# Altium project UprightAccelerationController.PrjPCB
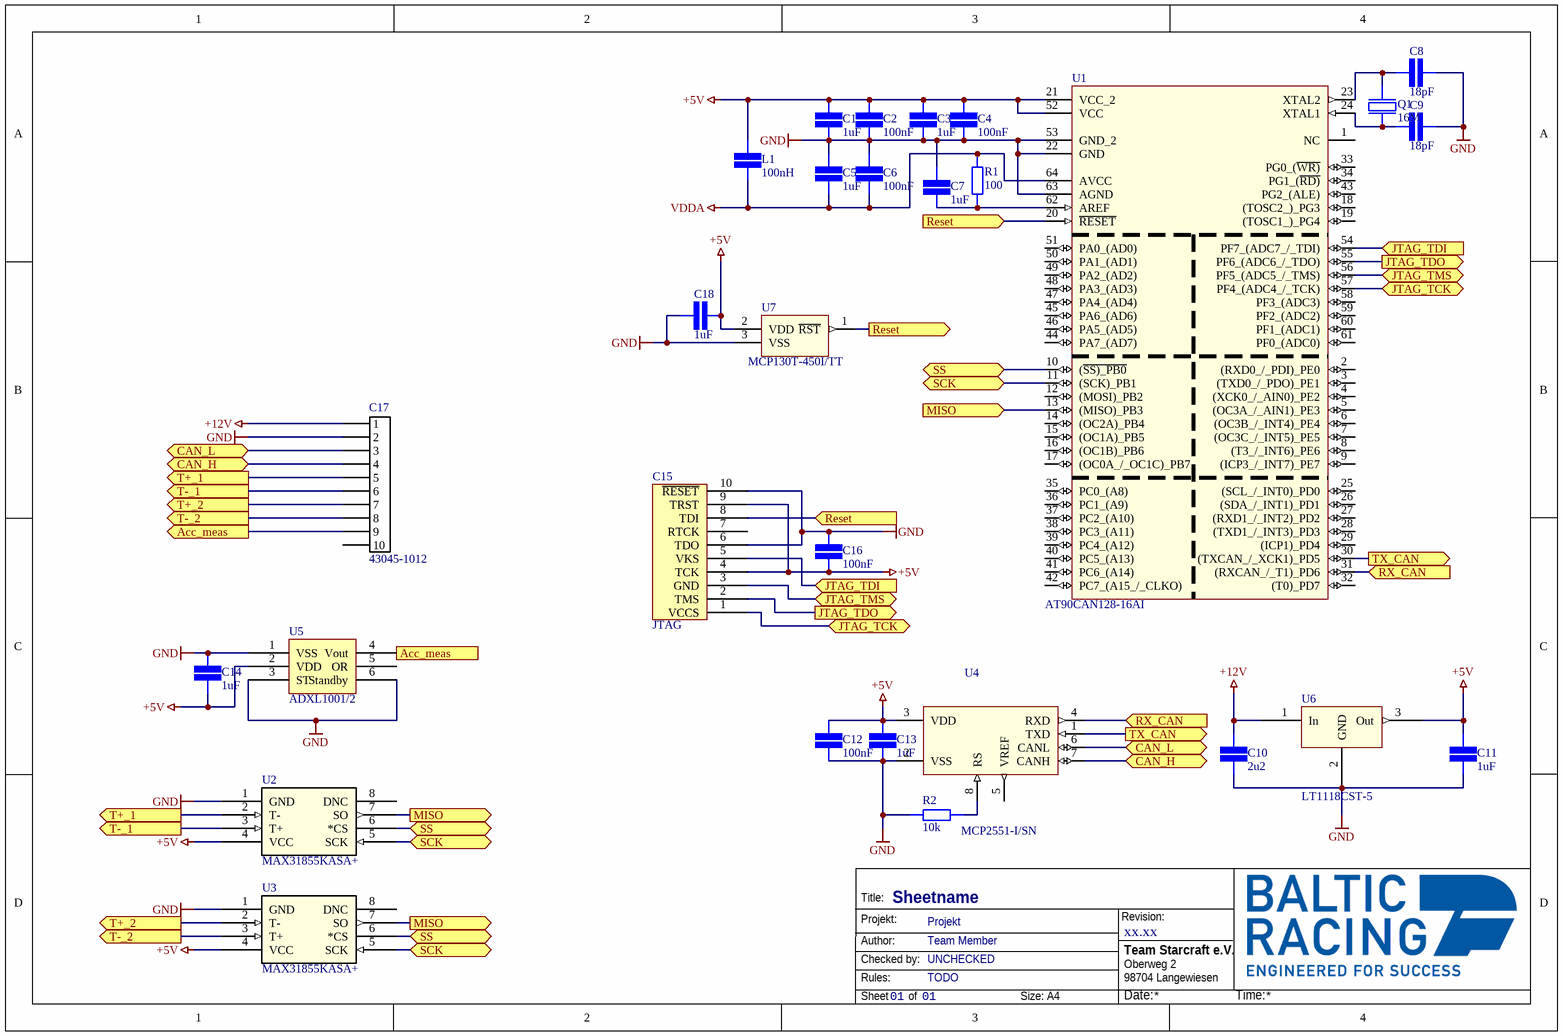
[diagram p0: main.SchDoc]
1 sheet, 29 parts. Net scope: flat (ports and power ports of the same name join across sheets).
Board file: UAC.PcbDoc

## Sheet main.SchDoc: Sheetname
size A4; Date: 05.10.2017; CheckedBy: UNCHECKED; Author: Team Member; Organization: Team Starcraft e.V.; Address1: Oberweg 2; Address2: 98704 Langewiesen; Revision: xx.xx; SheetNumber: 01; SheetTotal: 01; Rules: TODO; ProjectName: Projekt

### Parts
C1  value 1uF  [CAP 0603/1608]  (hidden comment: SMD Capacitor)
C2  value 100nF  [CAP 0603/1608]  (hidden comment: SMD Capacitor)
C3  value 1uF  [CAP 0603/1608]  (hidden comment: SMD Capacitor)
C4  value 100nF  [CAP 0603/1608]  (hidden comment: SMD Capacitor)
C5  value 1uF  [CAP 0603/1608]  (hidden comment: SMD Capacitor)
C6  value 100nF  [CAP 0603/1608]  (hidden comment: SMD Capacitor)
C7  value 1uF  [CAP 0603/1608]  (hidden comment: SMD Capacitor)
C8  value 18pF  [CAP 0603/1608]  (hidden comment: SMD Capacitor)
C9  value 18pF  [CAP 0603/1608]  (hidden comment: SMD Capacitor)
C10  value 2u2  [CAP 0603/1608]  (hidden comment: SMD Capacitor)
C11  value 1uF  [CAP 0603/1608]  (hidden comment: SMD Capacitor)
C12  value 100nF  [CAP 0603/1608]  (hidden comment: SMD Capacitor)
C13  value 1uF  [CAP 0603/1608]  (hidden comment: SMD Capacitor)
C14  value 1uF  [CAP 0603/1608]  (hidden comment: SMD Capacitor)
C15  JTAG  [SEGGER_10_PIN]  (no BOM)
C16  value 100nF  [CAP 0603/1608]  (hidden comment: SMD Capacitor)
C17  43045-1012  [43045-1012]
C18  value 1uF  [CAP 0603/1608]  (hidden comment: SMD Capacitor)
L1  value 100nH  [CAP 0603/1608]  (hidden comment: SMD Capacitor)
Q1  16M  [NDK NX5032GA]
R1  value 100  [STACKPOLE CSR0603]  (hidden comment: SMD Resistor)
R2  value 10k  [STACKPOLE CSR0603]  (hidden comment: SMD Resistor)
U1  AT90CAN128-16AI  [*QFP80P1600X1600X120-64N]
U2  MAX31855KASA+  [SOIC8]
U3  MAX31855KASA+  [SOIC8]
U4  MCP2551-I/SN  [*SOIC127P600X175-8N]
U5  ADXL1001/2  [PCBComponent_1]
U6  LT1118CST-5  [*SOT230P700X180-4N]
U7  MCP130T-450I/TT  [*SOT95P237X112-3N]

### Ports
Acc_meas (out), CAN_H (bidir), CAN_L (bidir), JTAG_TCK (bidir), JTAG_TDI (in), JTAG_TDO (out), JTAG_TMS (bidir), MISO (in), MISO (out), Reset (in), Reset (out), RX_CAN (in), SCK (bidir), SS (bidir), T+_1 (out), T+_2 (out), T-_1 (out), T-_2 (out), TX_CAN (out)

### Nets
+5V: C1.2 C2.2 C3.2 C4.2 C11.2 C12.2 C13.2 C14.1 C15.4(TCK) C15.9(TRST) C16.1 C18.1 L1.2 U1.21(VCC_2) U1.52(VCC) U2.4(VCC) U3.4(VCC) U4.3(VDD) U5.2(VDD) U6.3(Out) U7.2(VDD)
+12V: C10.2 C17.1 U6.1(In)
GND: C1.1 C2.1 C3.1 C4.1 C5.2 C6.2 C7.2 C8.1 C9.1 C10.1 C11.1 C12.1 C13.1 C14.2 C15.6(TDO) C15.10(~{RESET}) C16.2 C17.2 C18.2 R2.1 U1.22(GND) U1.53(GND_2) U1.63(AGND) U2.1(GND) U3.1(GND) U4.2(VSS) U5.1(VSS) U5.3(ST) U5.6(Standby) U6.2(GND) U7.3(VSS)
VDDA: C5.1 C6.1 L1.1 R1.2 U1.64(AVCC)
NetC7_1: C7.1 R1.1 U1.62(AREF)
NetC8_2: C8.2 Q1.2 U1.23(XTAL2)
NetC9_2: C9.2 Q1.1 U1.24(XTAL1)
NetC15_1: C15.1(VCCS) U1.57(PF4_(ADC4_/_TCK)) ; port JTAG_TCK
NetC15_2: C15.2(TMS) U1.55(PF6_(ADC6_/_TDO)) ; port JTAG_TDO
NetC15_3: C15.3(GND) U1.56(PF5_(ADC5_/_TMS)) ; port JTAG_TMS
NetC15_5: C15.5(VKS) U1.54(PF7_(ADC7_/_TDI)) ; port JTAG_TDI
NetC15_8: C15.8(TDI) U1.20(~{RESET}) U7.1(~{RST}) ; port Reset
NetC17_3: C17.3 U4.6(CANL) ; port CAN_L
NetC17_4: C17.4 U4.7(CANH) ; port CAN_H
NetC17_5: C17.5 U2.2(T-) ; port T+_1
NetC17_6: C17.6 U2.3(T+) ; port T-_1
NetC17_7: C17.7 U3.2(T-) ; port T+_2
NetC17_8: C17.8 U3.3(T+) ; port T-_2
NetC17_9: C17.9 U5.4(Vout) ; port Acc_meas
NetR2_2: R2.2 U4.8(RS)
NetU1_10: U1.10((~{SS)_PB0}) U2.6(*CS) U3.6(*CS) ; port SS
NetU1_11: U1.11((SCK)_PB1) U2.5(SCK) U3.5(SCK) ; port SCK
NetU1_13: U1.13((MISO)_PB3) U2.7(SO) U3.7(SO) ; port MISO
NetU1_30: U1.30((TXCAN_/_XCK1)_PD5) U4.1(TXD) ; port TX_CAN
NetU1_31: U1.31((RXCAN_/_T1)_PD6) U4.4(RXD) ; port RX_CAN

Not connected (* = marked no-connect by the designer): C15 7(RTCK); C17 10; U1 1(NC) 2((RXD0_/_PDI)_PE0) 3((TXD0_/_PDO)_PE1) 4((XCK0_/_AIN0)_PE2) 5((OC3A_/_AIN1)_PE3) 6((OC3B_/_INT4)_PE4) 7((OC3C_/_INT5)_PE5) 8((T3_/_INT6)_PE6) 9((ICP3_/_INT7)_PE7) 12((MOSI)_PB2) 14((OC2A)_PB4) 15((OC1A)_PB5) 16((OC1B)_PB6) 17((OC0A_/_OC1C)_PB7) 18((TOSC2_)_PG3) 19((TOSC1_)_PG4) 25((SCL_/_INT0)_PD0) 26((SDA_/_INT1)_PD1) 27((RXD1_/_INT2)_PD2) 28((TXD1_/_INT3)_PD3) 29((ICP1)_PD4) 32((T0)_PD7) 33(PG0_(~{WR)}) 34(PG1_(~{RD)}) 35(PC0_(A8)) 36(PC1_(A9)) 37(PC2_(A10)) 38(PC3_(A11)) 39(PC4_(A12)) 40(PC5_(A13)) 41(PC6_(A14)) 42(PC7_(A15_/_CLKO)) 43(PG2_(ALE)) 44(PA7_(AD7)) 45(PA6_(AD6)) 46(PA5_(AD5)) 47(PA4_(AD4)) 48(PA3_(AD3)) 49(PA2_(AD2)) 50(PA1_(AD1)) 51(PA0_(AD0)) 58(PF3_(ADC3)) 59(PF2_(ADC2)) 60(PF1_(ADC1)) 61(PF0_(ADC0)); U2 8(DNC); U3 8(DNC); U4 5(VREF); U5 5(OR)

### Notes on the sheet
- Title:
- Projekt:
- Revision:
- Author:
- Rules:
- Checked by:
- Sheet
- of
- Size:
- A4
- Date:
- Time:

### Library data of the parts
C1-C14 C16 C18 L1 = SMD Capacitor: Capacitor with multiple Footprints
C15 = Segger 10-Pin
C17 = MicroFit3.0 10-Pin: Micro-Fit 3.0 10-Pin / 600V / 8.5A
Q1 = 16 MHz Quartz
R1 R2 = SMD Resistor: Resistor with multiple footprints
U1 = AT90CAN128-16AI: Ic Mcu 8bit 128kb Flash 64tqfp; MF: Microchip; MP: AT90CAN128-16AI; Package: TQFP-64 Microchip; SnapEDA_Link: https://www.snapeda.com/parts/AT90CAN128-16AI/Microchip/view-part/?ref=snap; Price: None; Availability: Unavailable; Value: *
U2 U3 = MAX31855KASA+: No Description Available; Vendor: Maxim Integrated Products; Built_By: EMA_UL_Team; Manufacturer_Part_Number: MAX31855KASA+; Copyright: Copyright (C) 2018 Accelerated Designs. All rights reserved; RefDes: RefDes; Type: DEV; Value: Value
U4 = MCP2551-I/SN: MCP2551 Series 5.5 V 1 Mb/s Surface Mount High-Speed CAN Transceiver - SOIC-8; MF: Microchip; MP: MCP2551-I/SN; SnapEDA_Link: https://www.snapeda.com/parts/MCP2551-I/SN/Microchip/view-part/?ref=snap; Price: None; Package: SOIC-8 Microchip; Availability: Unavailable; Value: *
U5 = ADXL1001/2: pin to pad: 1>13 2>12 3>16 4>30 5>20 6>15
U6 = LT1118CST-5: or UA78M if used topdown (in and out changed)
U7 = MCP130T-450I/TT: System Supervisors - Power Supply Monitors with Reset Generators Open Drain Low; MF: Microchip; MP: MCP120T-450I/TT; Price: None; SnapEDA_Link: https://www.snapeda.com/parts/MCP120T-450I/TT/Microchip/view-part/?ref=snap; Package: SOT-23-3 Microchip; Availability: Unavailable; Value: *